# Altium project GPS Tracking Device.PrjPcb
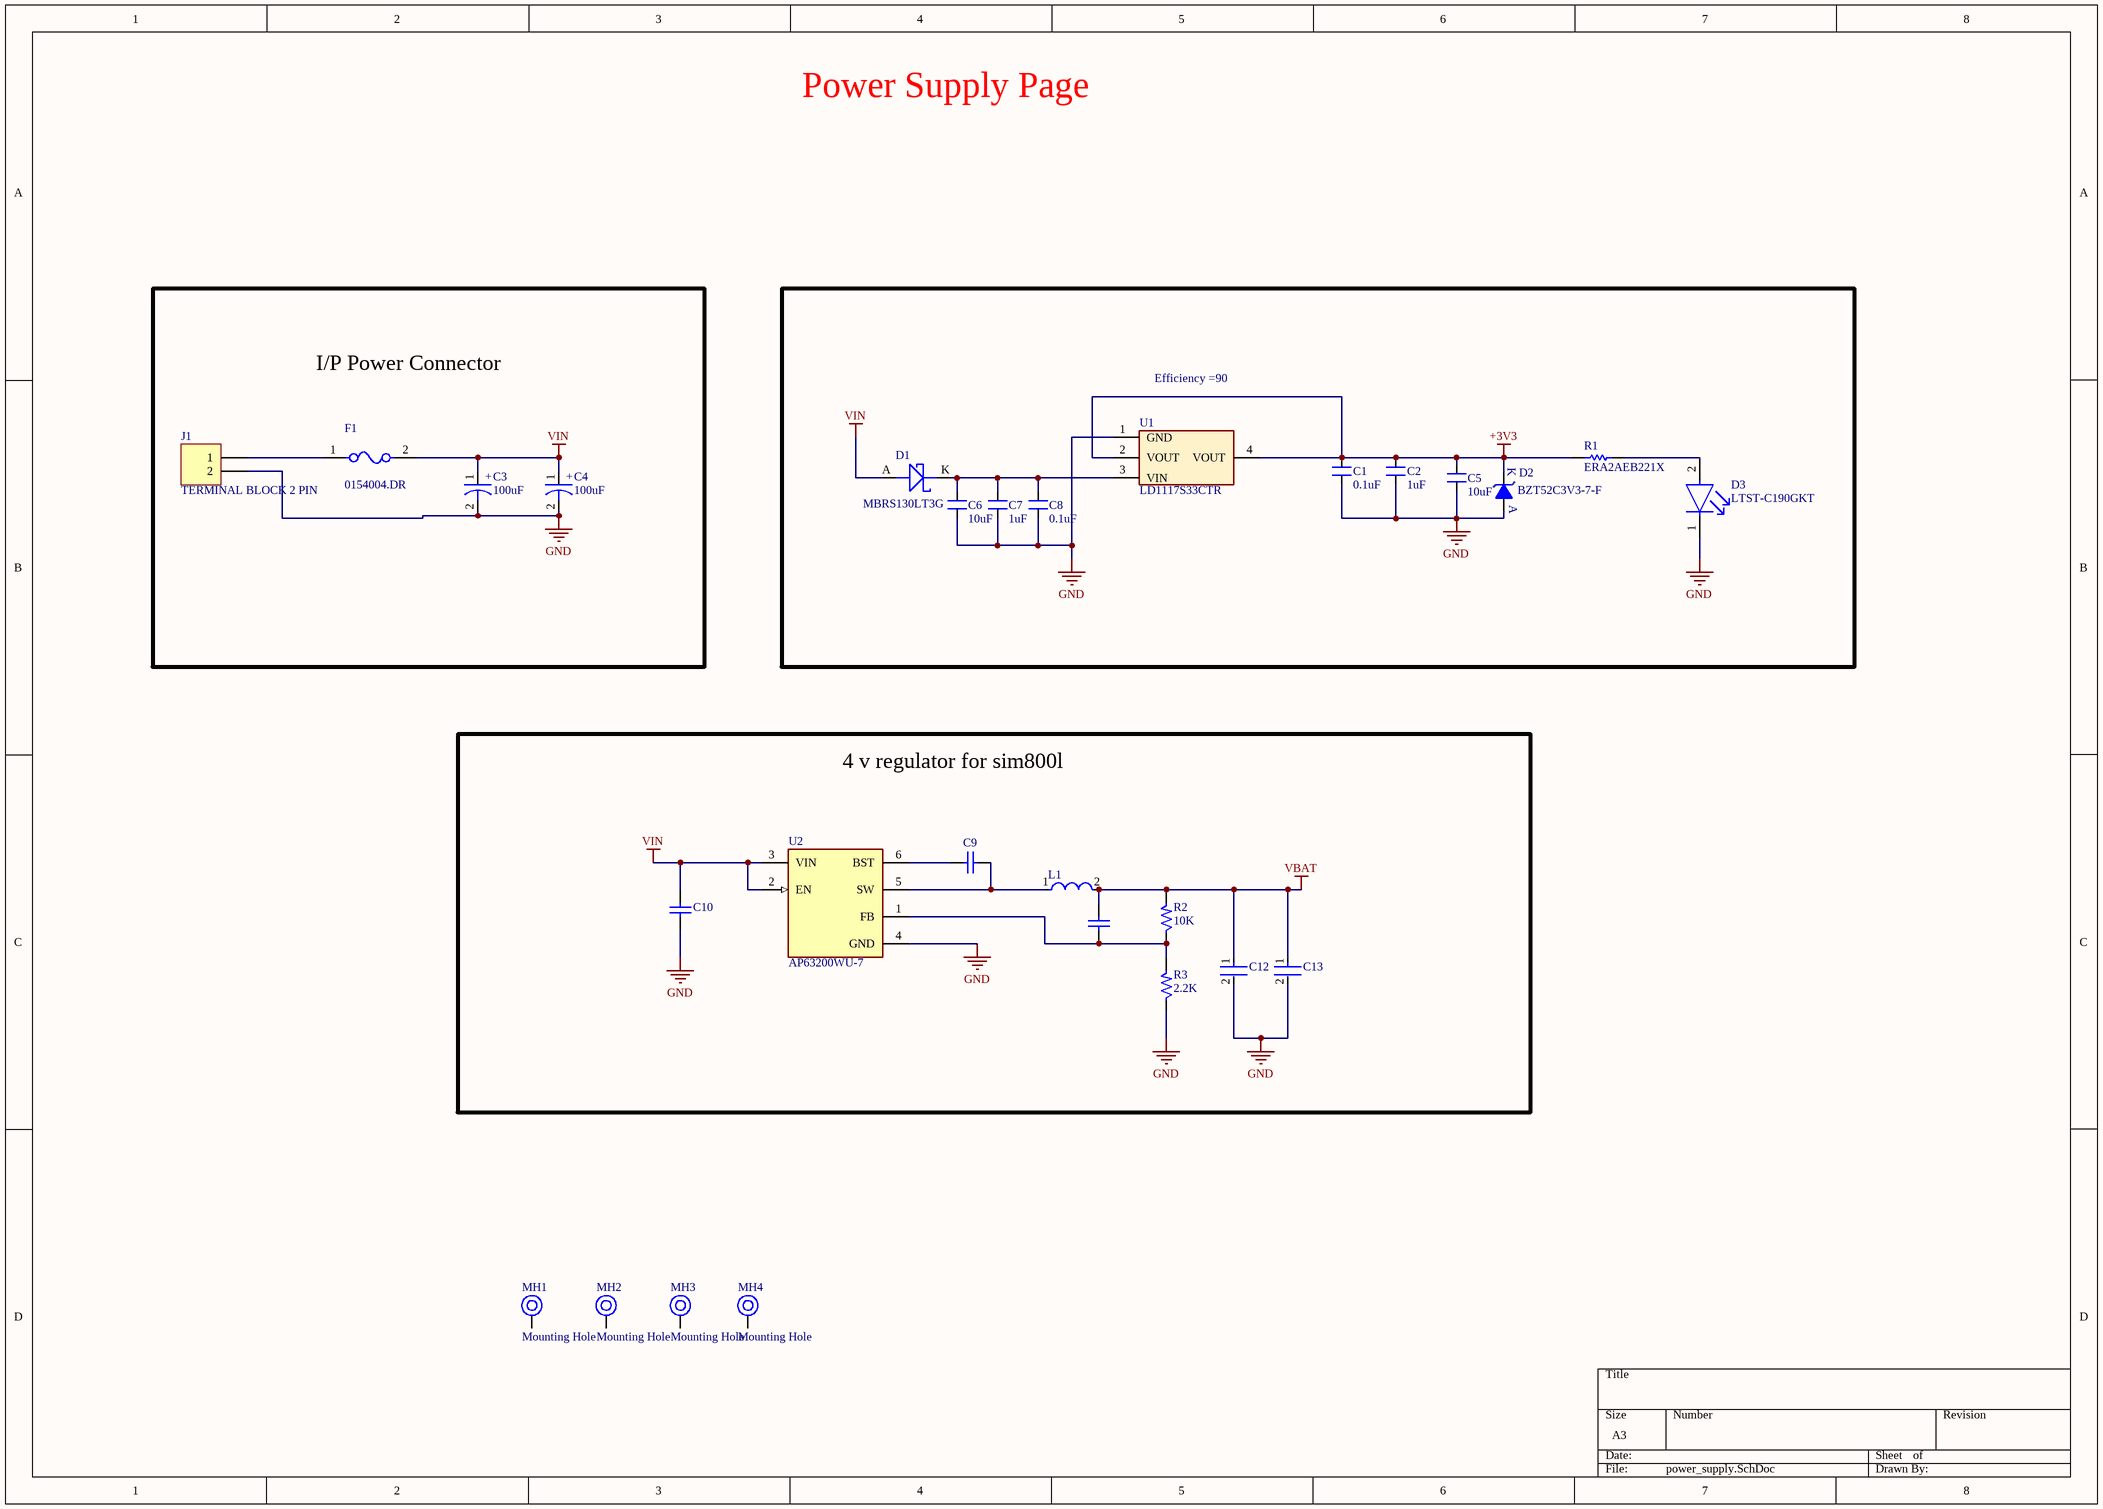
[diagram p0: power_supply.SchDoc]
3 sheets, 68 parts. Net scope: global (net labels, ports and power ports of the same name join across sheets).
Board file: GPS Tracking Device.PcbDoc
Sheets:
  power_supply.SchDoc
  ESP32_MCU.SchDoc
  GSM & SIM.SchDoc

## Sheet power_supply.SchDoc
size A3; SheetNumber: 1; SheetTotal: 3; SPICEModelCacheKXPDIREM: <root> / <DocumentId>KXPDIREM</DocumentId> / <CacheFrame Number="0"> / <Model Name="amk105cbj106_v-f" Kind="CKT"> / <Text>* AMK105CBJ106_V-F     SPICE MODEL  ( General Type ) / *-------------------------------------------------------------------------------------------------------- / * Model Generated by TAIYO YUDEN Corporation (http://www.ty-top.com) / * Version 1.0 / * TAIYO YUDEN Control No. 170508_140220 / *-------------------------------------------------------------------------------------------------------- / * / * Products Name : Multilayer Ceramic Capacitors / * / * Characteristics : / *     Capacitance : 10 uF , Rated Voltage : 4.0V , TCC : X5R / *     Case Size : 1.0 x 0.5 / 0.039 x 0.02 [mm/inch] , Thickness : 0.5 / 0.02 [mm/inch] / *     (Conditions: Temperature = 25 degC , DC Bias Current/Voltage = 0A / 0V) / * / * Frequency Range : 40Hz - 3GHz / * / * External Node Assignments : / * / *  1  o---| |---o  2 / * / *-------------------------------------------------------------------------------------------------------- / .SubCkt AMK105CBJ106_V-F 1 2 / **************************** / C0 1 110 7.4107u / Cm 1 101 0.96702u / C1 101 102 0.739u / Rc1 101 102 366.75 / C2 102 103 0.24354u / Rc2 102 103 47.641 / C3 103 110 0.14706u / Rc3 103 110 4.2209 / C2m 1 301 1.7678u / C21 301 302 4.7117u / Rc21 301 302 845.67 / C22 302 303 4.121u / Rc22 302 303 734.55 / C23 303 304 4.3096u / Rc23 303 304 562.67 / C24 304 305 2.6992u / Rc24 304 305 26.221 / C25 305 306 1.2642u / Rc25 305 306 46.471 / C26 306 307 2.5266u / Rc26 306 307 22.579 / C27 307 308 0.76655u / Rc27 307 308 4.4337 / C28 308 309 0.64691u / Rc28 308 309 2.6063 / C29 309 110 4901.4p / Rc29 309 110 1.4662 / Rp0 1 110 10Meg / L0 110 120 0.1817n / Lm 120 130 0.19649n / L1 120 121 0.098105n / RL1 121 130 0.12128 / L2 120 122 0.12674n / RL2 122 130 0.26881 / L3 120 123 0.76569n / RL3 123 130 0.47843m / CR 120 124 1.5221u / LR 124 125 0.35836n / RR 125 130 25.315m / CL 130 140 2.9027p / LL 130 140 0.10763n / RL 130 140 26.768 / Rs 140 2 2.766m / **************************** / .ends</Text> / </Model> / </CacheFrame> / </root>

### Parts
C1  0.1uF  [CAP_0805]
C2  1uF  [CAP_0805]
C3  100uF  [ACAP_P305_D393_H393_RAD]
C4  100uF  [ACAP_P305_D393_H393_RAD]
C5  10uF  [CAP_1206]
C6  10uF  [CAP_1206]
C7  1uF  [CAP_0805]
C8  0.1uF  [CAP_0805]
C9  04026D104KAT2A  [CAPC1005X56X25LL10T15]  (value not drawn)
C10  AMK105CBJ106MV-F  [CAPC0402(1005)60_N]  (value not drawn)
C11  GRM1555C1H101JA01D  [CAPC1005X55X25ML05T10]  (value not drawn)
C12  GRM21BR60J226ME39L  [FP-GRM21B-0_15-IPC_B]  (value not drawn)
C13  GRM21BR60J226ME39L  [FP-GRM21B-0_15-IPC_B]  (value not drawn)
D1  MBRS130LT3G  [DIO_SMB_DO-214AA]
D2  BZT52C3V3-7-F  [DIO_SOD-123]
D3  LTST-C190GKT  [FP-LTST-C190GKT-MFG]
F1  0154004.DR  [FP-0154-MFG]
J1  TERMINAL BLOCK 2 PIN  [CON2_P196_1729128_TH_ST]
L1  MLZ1005M2R2WT000  [FP-MLZ1005-IPC_B]  (value not drawn)
MH1  Mounting Hole  [MOUNTING]
MH2  Mounting Hole  [MOUNTING]
MH3  Mounting Hole  [MOUNTING]
MH4  Mounting Hole  [MOUNTING]
R1  ERA2AEB221X  [RESC1005X40X25LL10T10]
R2  10K  [RES_0603]
R3  2.2K  [RES_0805]
U1  LD1117S33CTR  [SOT223_3]
U2  AP63200WU-7  [FP-TSOT26-MFG]

### Blocks framed on the sheet
I/P Power Connector: C3 C4 F1 J1
Efficiency =90: C1 C2 C5-C8 D1-D3 R1 U1
4 v regulator for sim800l: C9-C13 L1 R2 R3 U2

### Nets
+3V3: C1.2 C2.2 C5.2 D2.K R1.1 U1.2(VOUT) U1.4(VOUT)
GND: C1.1 C2.1 C3.2 C4.2 C5.1 C6.1 C7.1 C8.1 C10.1 C12.2 C13.2 D2.A D3.1(C) J1.2 R3.1 U1.1(GND) U2.4(GND)
VBAT: C11.2 C12.1 C13.1 L1.2 R2.2
VIN: C3.1 C4.1 C10.2 D1.A F1.2 U2.2(EN) U2.3(VIN)
NetC6_2: C6.2 C7.2 C8.2 D1.K U1.3(VIN)
NetC9_1: C9.1 U2.6(BST)
NetC9_2: C9.2 L1.1 U2.5(SW)
NetC11_1: C11.1 R2.1 R3.2 U2.1(FB)
NetD3_2: D3.2(A) R1.2
NetF1_1: F1.1 J1.1

Not connected (* = marked no-connect by the designer): MH1 1; MH2 1; MH3 1; MH4 1

### Notes on the sheet
- Power Supply Page
- (in symbol CAP-P_100uF-50V-20%-RAD) +

### Library data of the parts
C1 C8 = CAP_0.1uF-50V-10%-0805: 0.1µF ±10% 50V Ceramic Capacitor X7R 0805 (2012 Metric); Manufacturer: Samsung; Manufacturer Part Number: CL21B104KBCNNNC; Alternate Part Number-1: NA; Case/Package: 0805; Supplier-1: SIRICOM; Supplier Part Number-1: 0805B104K500CT
C2 C7 = CAP_1uF-50V-5%-0805: 1µF ±5% 50V Ceramic Capacitor X7R 0805 (2012 Metric); Manufacturer: Samsung; Manufacturer Part Number: CC0805JKX7R9BB105; Alternate Part Number-1: 0805F105M500NT; Case/Package: 0805; Supplier-1: SIRICOM; Supplier Part Number-1: CL21B105KBFNNNE
C3 C4 = CAP-P_100uF-50V-20%-RAD: 100µF 50V Aluminum Polymer Capacitor Radial, Can - SMD 28mOhm 4000 Hrs @ 125°C; Manufacturer: Nichicon; Manufacturer Part Number: GYA1H101MCQ1GS; Alternate Part Number-1: VEU101M1HTR-1010; Case/Package: Radial-SMD; Supplier-1: SP ROAD; Supplier Part Number-1: GYA1H101MCQ1GS
C5 C6 = CAP_10uF-50V-10%-1206: 10µF ±10% 50V Ceramic Capacitor X7R 1206 (3216 Metric); Manufacturer: KEMET; Manufacturer Part Number: CL31B106KBHNNNE; Alternate Part Number-1: GRT31CR61H106ME01L; Case/Package: 1206; Supplier-1: SIRICOM; Supplier Part Number-1: CC1206KKX5R9BB106
C9 = CMP-2008-02743-1: Manufacturer: AVX Interconnect / Elco; Part Number: 04026D104KAT2A
C10 = CMP-1034-02139-2: None; Voltage Rating: 4V; Capacitance: 10uF; Dielectric: X5R; Tolerance: 20%; Width: 0.02inch; Halogen Free: Halogen Free; Termination: SMD/SMT; Voltage Rating (DC): 4V; Length: 0.039inch; RoHS Compliant: Yes; Case/Package: 0402; Mount: Surface Mount; Case Code (Imperial): 0402; Min Operating Temperature: -55°C; Packaging: Tape and Reel; Height: 0.5mm; Case Code (Metric): 1005; Max Operating Temperature: 85°C; Series: M; Package Quantity: 1; Thickness: 0.028inch; Construction: Flat
C11 = CMP-2008-03915-1: Manufacturer: Murata; Part Number: GRM1555C1H101JA01D
C12 C13 = CMP-2007-03385-2: Chip Multilayer Ceramic Capacitors for General Purpose, 0805, 22uF, X5R, 15%, 20%, 6.3V; Material: Ceramic; Max Operating Temperature: 85°C; Voltage: 6.3V; Min Operating Temperature: -55°C; Case/Package: 0805; Thickness: 0.053inch; Dielectric: X5R; Packaging: Tape and Reel; Depth: 1.25mm; Termination: SMD/SMT; Voltage Rating (DC): 6.3V; Radiation Hardening: No; Tolerance: 20%; Mount: Surface Mount; Lead Free: Lead Free; Package Quantity: 1; REACH SVHC: No SVHC; Voltage Rating: 6.3V; Capacitance: 22uF; Length: 2mm; Case Code (Imperial): 0805; Case Code (Metric): 2012; Width: 0.049inch; Height: 1.25mm
D1 = DIO-S_445mV-30V-2A-SMB: Diode Schottky 30V 2A Surface Mount SMB; Manufacturer: ON Semiconductor; Alternate Part Number-1: NA; Manufacturer Part Number: MBRS130LT3G; Case/Package: SMB; Supplier-1: ARROW; Supplier Part Number-1: MBRS130LT3G
D2 = DIO-Z_3.3V-500mW-SOD123: Zener Diode 3.3V 500mW ±6% Surface Mount SOD-123; Manufacturer: Diodes Incorporated; Alternate Part Number-1: NA; Manufacturer Part Number: BZT52C3V3-7-F; Case/Package: SOD-123; Supplier-1: Digikey; Supplier Part Number-1: BZT52C3V3-FDICT-ND
D3 = CMP-22017-000005-2: LED GREEN CLEAR CHIP SMD; Dominant Wavelength: 569nm; Reverse Voltage: 5V; Lens Color: Colorless; Viewing Angle: 130°; Voltage: 2V; Forward Current: 30mA; Power Dissipation: 100mW; Luminous Intensity: 6mcd; Number of LEDs: 1; Forward Voltage: 2.1V; Wavelength: 565nm; Test Current: 10mA; Min Operating Temperature: -55°C; Lens Style: Clear; Mount: Surface Mount; Width: 0.8mm; Packaging: Tape and Reel; Lens Transparency: Clear; Case Code (Metric): 1608; Depth: 0.8mm; Case Code (Imperial): 0603; Case/Package: 0603; Number of Pins: 2; Max Operating Temperature: 85°C; Lead Free: Lead Free; Number of Elements: 1; Length: 1.6mm; Height: 0.8mm; Package Quantity: 1; Power Rating: 100mW; Radiation Hardening: No; Illumination Color: Green; Color: Green
F1 = CMP-08605-000003-1: FUSE BRD MNT 4A 125VAC/VDC 2SMD; Manufacturer: Littelfuse; Fuse Blow Speed: Fast; Max Fuse Ac Voltage: 125V; Lead Free: Yes; Device Class L3: unset; Manufacturer Part Number: 0154004.DR; Device Class L2: Fuses; Package: 0154; ComponentLink2Description: Datasheet; Temperature Range Low: -55°C; Temperature Range High: +125°C; Device Class L1: Circuit Protection; Height: 3.81mm; Temperature: -55°C to +125°C; Mouser Description: Surface Mount Fuses Fuseblock w/ fuse 4A OMNI BLOK 154; Automotive: No; Digikey Description: FUSE BRD MNT 4A 125VAC/VDC 2SMD; RoHS: TRUE; Category: Fuse; Fuse Current: 4A; Max Fuse Dc Voltage: 125V; ComponentLink2URL: https://www.littelfuse.com/~/media/electronics/datasheets/fuses/littelfuse_fuse_154_154t_154l_154tl_datasheet.pdf.pdf; Octopart: https://octopart.com/0154004.dr-littelfuse-565861
J1 = CON-TB_2X1-196-ST-TH: 2 Pins, 1 Row 5mm Pitch, straight Connector, male; Manufacturer: Phoenix Contact; Manufacturer Part Number: MKDSN1,5/2; Alternate Part Number-1: NA; Case/Package: TH-CON; Supplier-1: SP ROAD; Supplier Part Number-1: MKDSN1,5/2
L1 = CMP-08253-000201-1: Shielded Multilayer Inductor 2.2uH ±20% 350mA 715mΩ SMD 0402; Core Material: Ferrite; Saturation Current: 60mA; DC Resistance (DCR): 715mR; Self Resonant Frequency: 120MHz; Test Frequency: 2MHz; RoHS Compliant: Yes; Tolerance: 20%; Current Rating: 350mA; Min Operating Temperature: -55°C; Case Code (Imperial): 0402; Length: 0.039inch; Case/Package: 0402; Inductance: 2.2uH; Mount: Surface Mount; Package Quantity: 10000; Shielding: Shielded; Width: 0.02inch; Case Code (Metric): 1005; Height - Seated (Max): 0.022inch; Max Operating Temperature: 125°C; Packaging: Tape and Reel
MH1-MH4 = MH_3.5H_6D: Manufacturer Part Number: NA; Case/Package: TH; Manufacturer: NA; Supplier-1: NA; Supplier Part Number-1: NA; Alternate Part Number-1: NA
R1 = CMP-2002-05880-1: Manufacturer: Panasonic; Part Number: ERA2AEB221X
R2 = RES_10K-0.1W-1%-0603: 10 kOhms ±1% 0.1W, 1/10W Chip Resistor 0603 (1608 Metric) Automotive AEC-Q200 Thick Film; Manufacturer: Walsin; Manufacturer Part Number: WR06X1002FTL; Alternate Part Number-1: 0603WAJ0103T5E; Case/Package: 0603; Supplier-1: SIRICOM; Supplier Part Number-1: WR06X1002FTL
R3 = RES_2.2K-0.125W-1%-0805: 2.2 kOhms ±1% 0.125W, 1/8W Chip Resistor 0805 (2012 Metric) Thick Film; Manufacturer: Stackpole Electronics; Manufacturer Part Number: CRG0805F2K2; Alternate Part Number-1: CR0805F82201G; Case/Package: 0805; Supplier-1: SIRICOM; Supplier Part Number-1: WR08X2201FTL
U1 = REG_15V-3.3V-0.9A-12W-SOT223: Linear Voltage Regulator IC 1 Output 800mA SOT-223; Manufacturer: STMicroelectronics; Alternate Part Number-1: NA; Manufacturer Part Number: LD1117S33CTR; Case/Package: SOT223; Supplier-1: SP ROAD; Supplier Part Number-1: LD1117S33CTR
U2 = CMP-12757-000010-1: IC REG BUCK ADJUSTABLE 2A TSOT26; Manufacturer: Diodes Inc.; Switching Frequency: 500kHz; Max Supply Voltage: 32V; Number Of Outputs: 1; Nominal Supply Current: 22uA; Min Supply Voltage: 3.8V; Output Type: AdjustableProgrammable; Max Junction Temp: +160°C; Standoff Height: 0.01mm; Octopart: https://octopart.com/ap63200wu-7-diodes+inc.-98099548; Height: 1mm; Temperature Range Low: -40°C; Output Current: 2A; ComponentLink2URL: https://www.diodes.com/assets/Datasheets/AP63200-AP63201-AP63203-AP63205.pdf; Switching Topology: Buck; Automotive: No; Device Class L1: Integrated Circuits (ICs); Ipc Land Pattern Name: SOT95P280X100-6; Package: TSOT26; Temperature Range High: +85°C; RoHS: TRUE; Ambient Temperature Range High: +85°C; Device Class L3: Voltage Regulators - Switching; Temperature: -40°C to +85°C; Device Class L2: Power Management ICs; Footprint Url: https://www.diodes.com/assets/Package-Files/TSOT26.pdf; Mouser Description: AP63200 Series 1.2 V 2 A Adjustable Synchronous Buck Converter - TSOT-26; Category: IC; ComponentLink2Description: Datasheet; Digikey Description: IC REG BUCK ADJUSTABLE 2A TSOT26; Lead Free: Yes; Ambient Temperature Range Low: -40°C; Manufacturer Part Number: AP63200WU-7

## Sheet ESP32_MCU.SchDoc
size A3; SheetNumber: 2; SheetTotal: 3
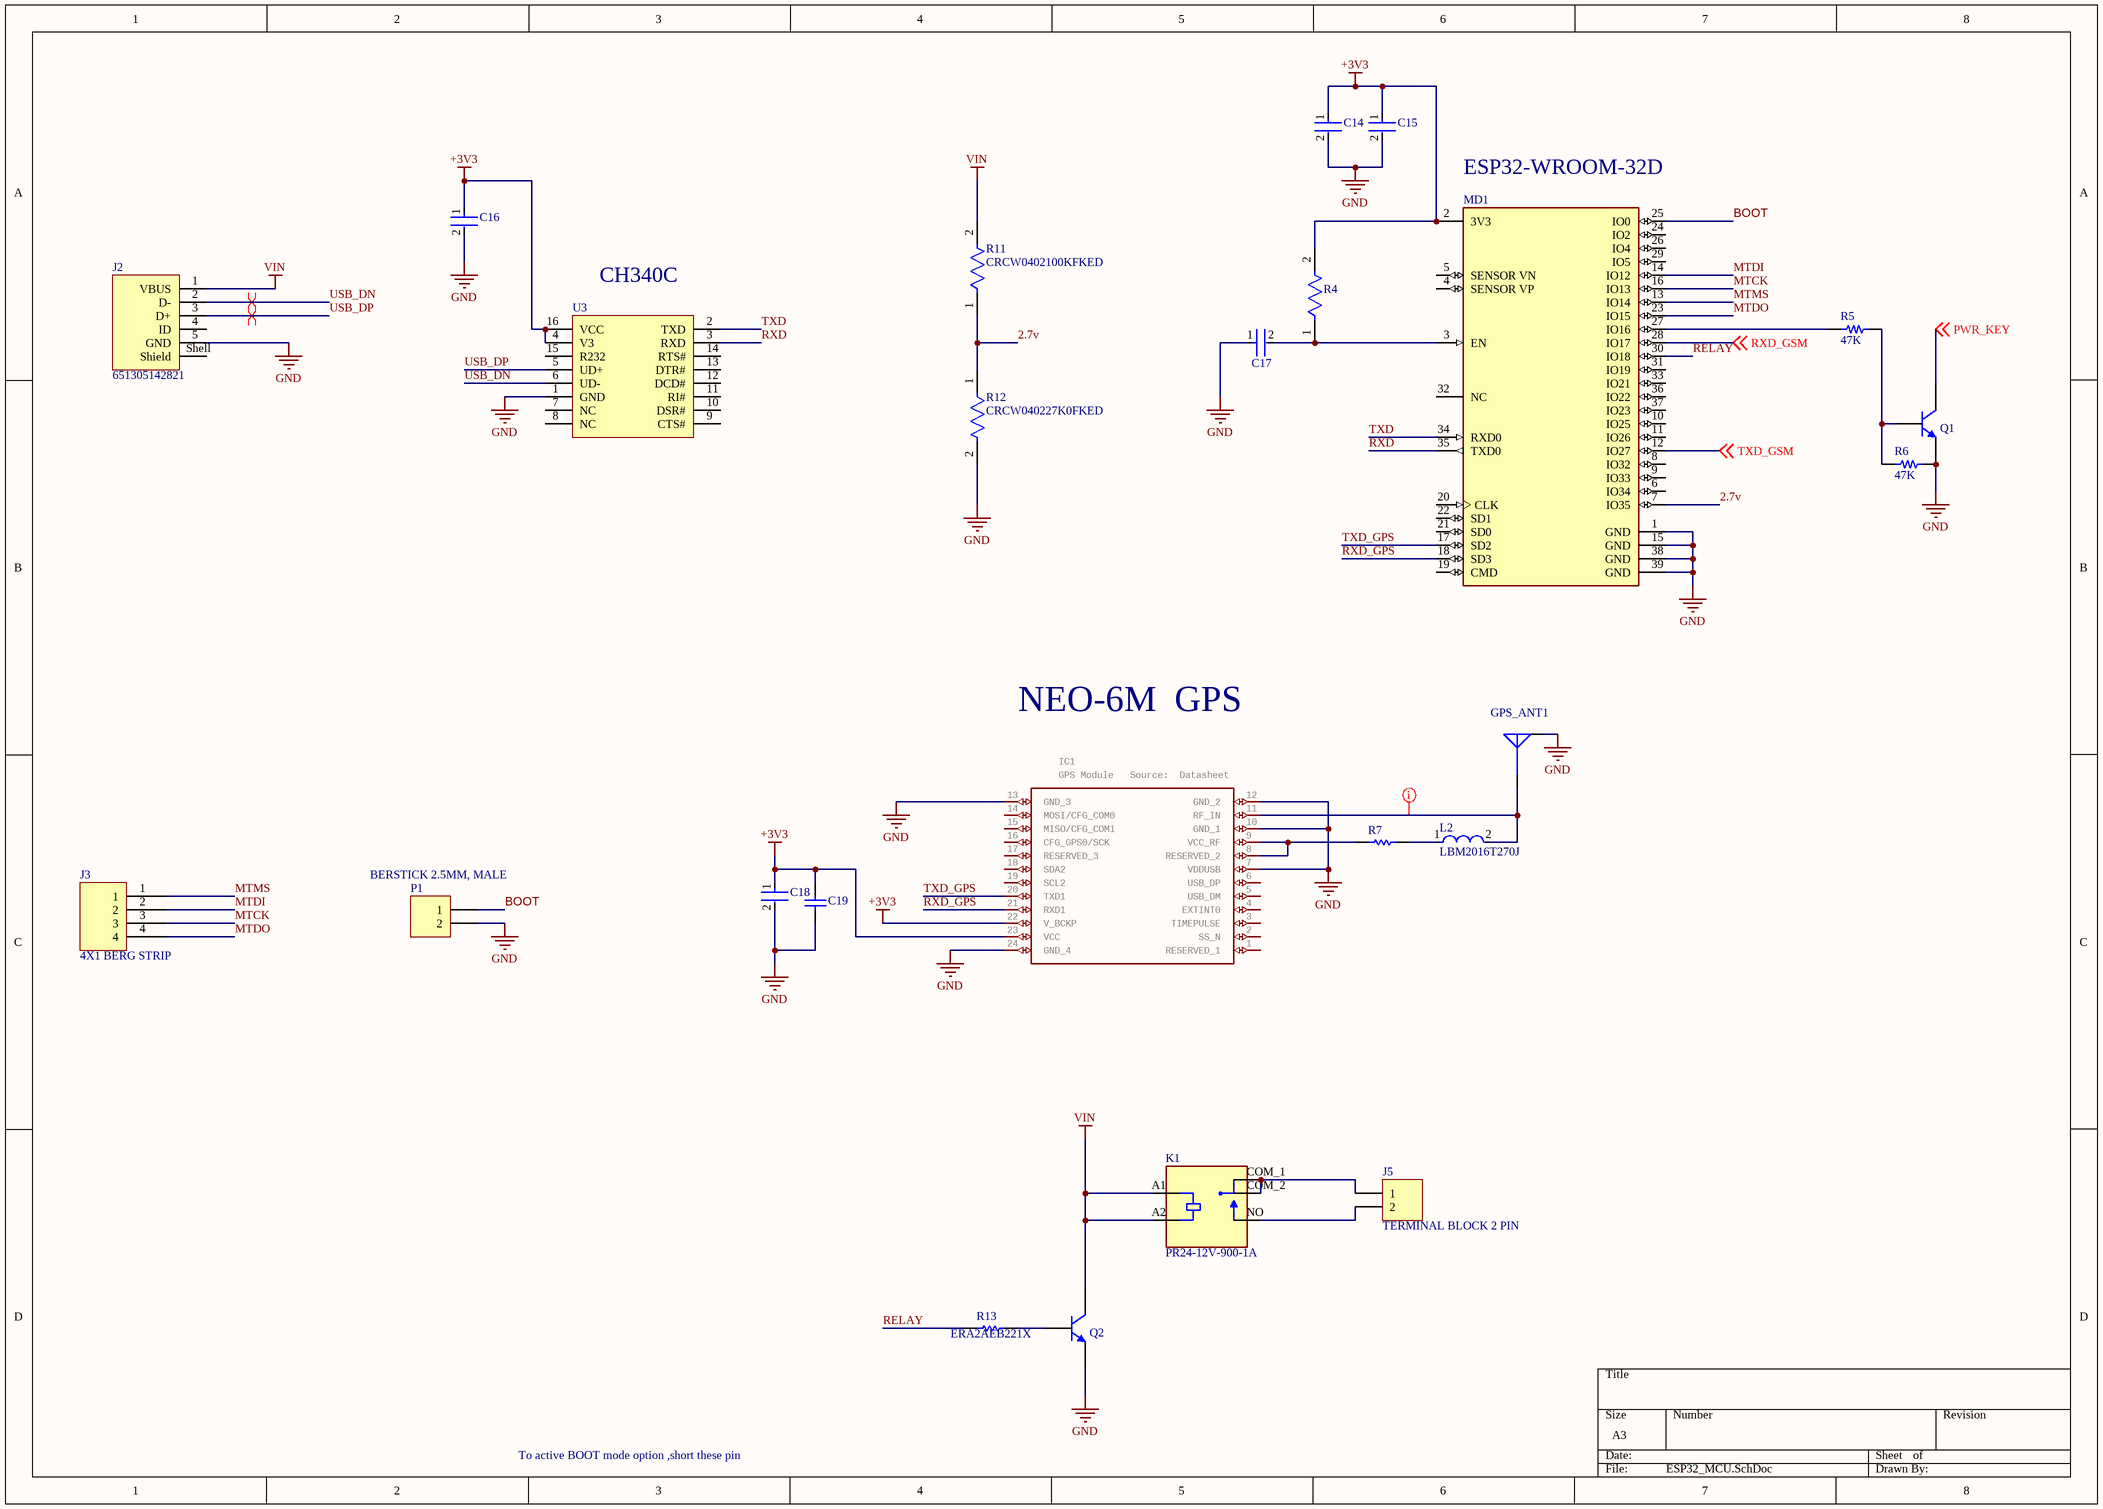
[diagram p1: ESP32_MCU.SchDoc]

### Parts
C14  C0402C104K8RACTU  [FP-C0402-BB-MFG]  (value not drawn)
C15  C0402C106M9PACTU  [FP-C0402C106M9PACTU-MFG]  (value not drawn)
C16  C0402C104K8RACTU  [FP-C0402-BB-MFG]  (value not drawn)
C17  CC0402KRX5R5BB105  [FP-CC0402-MFG]  (value not drawn)
C18  C0402C104K8RACTU  [FP-C0402-BB-MFG]  (value not drawn)
C19  C0402C475M7PACTU  [CAPC1005X60X30ML05T10]  (value not drawn)
GPS_ANT1  UFL  [MOLEX SD-734120110]  (value not drawn)
IC1  GPS Module   Source:  Datasheet  [NEO6M0001]
J2  651305142821  [651305142821]
J3  4X1 BERG STRIP  [CON4_100_40D72_TH_ST_MALE]
J5  TERMINAL BLOCK 2 PIN  [CON2_P196_1729128_TH_ST]
K1  PR24-12V-900-1A  [RELAY_PR24-12V-900-1A]
L2  LBM2016T270J  [FP-LBM2016-1_6-0_2-IPC_C]
MD1  ESP32-WROOM-32D  [FP-ESP32-WROOM-32D-MFG]
P1  BERSTICK 2.5MM, MALE  [CON2_100_43D62_TH_ST]
Q1  8050  [SOT-23-3 2.9X2.4MM P0.95MM]  (value not drawn)
Q2  8050  [SOT-23-3 2.9X2.4MM P0.95MM]  (value not drawn)
R4  CRCW040210K0JNED  [FP-CRCW0402-e3-IPC_B]  (value not drawn)
R5  47K  [RES 0603_1608]
R6  47K  [RES 0603_1608]
R7  CRCW040222R0FKED  [RESC1005X40X25LL05T05]  (value not drawn)
R11  CRCW0402100KFKED  [FP-CRCW0402-e3-IPC_C]
R12  CRCW040227K0FKED  [FP-CRCW0402-e3-IPC_A]
R13  ERA2AEB221X  [RESC1005X40X25LL10T10]
U3  CH340C  [SOIC16_50_284_25X90_SMT]

### Nets
+3V3: C14.1 C15.1 C16.1 C18.1 C19.2 IC1.22(V_BCKP) IC1.23(VCC) MD1.2(3V3) R4.2 U3.4(V3) U3.16(VCC)
GND: C14.2 C15.2 C16.2 C17.1 C18.2 C19.1 GPS_ANT1.G IC1.7(VDDUSB) IC1.10(GND_1) IC1.12(GND_2) IC1.13(GND_3) IC1.24(GND_4) J2.5(GND) MD1.1(GND) MD1.15(GND) MD1.38(GND) MD1.39(GND) P1.2 Q1.2(E) Q2.2(E) R6.1 R12.2 U3.1(GND)
VIN: J2.1(VBUS) K1.A1(COIL1) K1.A2(COIL2) Q2.3(C) R11.2
2.7v: MD1.7(IO35) R11.1 R12.1
BOOT: MD1.25(IO0) P1.1
MTCK: J3.3 MD1.16(IO13)
MTDI: J3.2 MD1.14(IO12)
MTDO: J3.4 MD1.23(IO15)
MTMS: J3.1 MD1.13(IO14)
PWR_KEY: Q1.3(C) ; off-sheet PWR_KEY
RELAY: MD1.30(IO18) R13.1
RXD: MD1.35(TXD0) U3.3(RXD)
RXD_GPS: IC1.21(RXD1) MD1.18(SD3)
RXD_GSM: MD1.28(IO17) ; off-sheet RXD_GSM
TXD: MD1.34(RXD0) U3.2(TXD)
TXD_GPS: IC1.20(TXD1) MD1.17(SD2)
TXD_GSM: MD1.12(IO27) ; off-sheet TXD_GSM
USB_DN: J2.2(D-) U3.6(UD-)
USB_DP: J2.3(D+) U3.5(UD+)
NetC17_2: C17.2 MD1.3(EN) R4.1
NetGPS_ANT1_S: GPS_ANT1.S IC1.11(RF_IN) L2.2
NetIC1_8: IC1.8(RESERVED_2) IC1.9(VCC_RF) R7.1
NetJ5_1: J5.1 K1.COM_1(COM1) K1.COM_2(COM2)
NetJ5_2: J5.2 K1.NO
NetL2_1: L2.1 R7.2
NetMD1_27: MD1.27(IO16) R5.2
NetQ1_1: Q1.1(B) R5.1 R6.2
NetQ2_1: Q2.1(B) R13.2

Not connected (* = marked no-connect by the designer): IC1 1(RESERVED_1) 2(SS_N) 3(TIMEPULSE) 4(EXTINT0) 5(USB_DM) 6(USB_DP) 14(MOSI/CFG_COM0) 15(MISO/CFG_COM1) 16(CFG_GPS0/SCK) 17(RESERVED_3) 18(SDA2) 19(SCL2); J2 4(ID) Shell(Shield); MD1 4(SENSOR_VP) 5(SENSOR_VN) 6(IO34) 8(IO32) 9(IO33) 10(IO25) 11(IO26) 19(CMD) 20(CLK) 21(SD0) 22(SD1) 24(IO2) 26(IO4) 29(IO5) 31(IO19) 32(NC) 33(IO21) 36(IO22) 37(IO23); U3 7(NC) 8(NC) 9(CTS#) 10(DSR#) 11(RI#) 12(DCD#) 13(DTR#) 14(RTS#) 15(R232)

### Layout directives
differential pair; differential pair class diff_90: USB_DN, USB_DP
net class GPS_ANT: NetGPS_ANT1_S

### Notes on the sheet
- NEO-6M  GPS
- To active BOOT mode option ,short these pin

### Library data of the parts
C14 C16 C18 = CMP-2008-03086-2: CAP CER 0.1UF 10V X7R 0402; Manufacturer: Kemet; Capacitance: 0.10 μF; Tolerance: 0.1; Temperature Coefficient: 15%; Value: 0.10 μF; Material: Ceramic; Automotive: No; Temperature Range High: +125°C; Octopart: https://octopart.com/c0402c104k8ractu-kemet-106349; ComponentLink2Description: Datasheet; ComponentLink2URL: https://content.kemet.com/datasheets/KEM_C1002_X7R_SMD.pdf; Temperature: -55°C to +125°C; RoHS: TRUE; Temperature Range Low: -55°C; Temperature Characteristic: X7R; Lead Free: Yes; Height: 0.55mm; Manufacturer Part Number: C0402C104K8RACTU; Voltage Rating: 10 V; Category: Cap; Device Class L3: Ceramic Capacitors; Digikey Description: CAP CER 0.1UF 10V X7R 0402; Package: C0402-BB; Device Class L1: Passive Components; Ipc Land Pattern Name: CAPC10050X50; Mouser Description: Multilayer Ceramic Capacitors MLCC - SMD/SMT 10volts 0.1uF X7R 10%; Device Class L2: Capacitors
C15 = CMP-03020-034678-1: CAP CER 10UF 6.3V X5R 0402; Tolerance: 20%; Dielectric Material: Ceramic; Voltage Rating: 6.3V; Thickness: 0.028inch; REACH SVHC: No SVHC; RoHS Compliant: Yes; Case Code (Metric): 1005; Lead Free: Lead Free; Length: 0.039inch; Max Operating Temperature: 85°C; Capacitance: 10uF; Voltage Rating (DC): 6.3V; Min Operating Temperature: -55°C; Case/Package: 0402; Mount: Surface Mount; Case Code (Imperial): 0402; Dielectric: X5R; Packaging: Cut Tape; Width: 0.02inch
C17 = CMP-2100-03591-2: CAP CER 1UF 6.3V X5R 0402; Manufacturer: YAGEO; Automotive Grade: NA; Material: Ceramic; Tolerance: 0.1; Temperature Coefficient: 30ppm/°C; Voltage Rating: 6.3 V; Temperature Range Low: -55°C; Digikey Description: CAP CER 1UF 6.3V X5R 0402; Capacitance: 1 uF; Height: 0.55mm; Automotive: No; ComponentLink2URL: http://www.yageo.com/documents/recent/UPY-GP_NP0_16V-to-50V_16.pdf; Device Class L2: Capacitors; RoHS: TRUE; Temperature Range High: +125°C; Device Class L3: Ceramic Capacitors; Device Class L1: Passive Components; Temperature Characteristic: X5R; Package: CC0402; Octopart: https://octopart.com/cc0402krx5r5bb105-yageo-42244618; ComponentLink2Description: Datasheet; Temperature: -55°C to +125°C; Manufacturer Part Number: CC0402KRX5R5BB105; Mouser Description: Multilayer Ceramic Capacitors MLCC - SMD/SMT 1uF 6.3V X5R 10%; Category: Cap; Footprint Url: http://www.yageo.com/exep/pages/download/literatures/UPY-C_GEN_24.pdf; Lead Free: Yes; Ipc Land Pattern Name: CAPC10050X50; Value: 1 uF
C19 = CMP-2008-02047-1: Manufacturer: Kemet; Part Number: C0402C475M7PACTU
GPS_ANT1 = UFL MOLEX SD-734120110: PartNumber: MOLEX SD-734120110
IC1 = NEO-6M-0-001: Manufacturer_Name: U-Blox; GateName_1: G$1; SymbolName_1: NEO-6M-0-001; LibraryName: NEO-6M-0-001; DeviceSetName: NEO-6M-0-001; Package: NEO6M0001; Manufacturer_Part_Number: NEO-6M-0-001; Height: 2.6mm
J2 = CMP-1502-03247-2: NexarPartId: 19991175; Operating Supply Voltage: 30V; Current Rating: 1A; Contact Resistance: 20mΩ; Connector Type: USB; Number of Contacts: 5; USB Standard: USB 2.0; Gender: Receptacle; Insulation Resistance: 1GΩ; REACH SVHC: Unknown; Contact Plating: Gold; Min Operating Temperature: -40°C; Features: Shielded; RoHS: Compliant; Contact Material: Copper; Packaging: Tape and Reel; Termination: SMD/SMT; Max Operating Temperature: 105°C; Orientation: Horizontal; Number of Pins: 5; Mount: Horizontal, Surface Mount; Lead Free: Lead Free
J3 = CON-BS-PLG_4X1-100-ST-TH: 4 Pins, 1 Row 2.54mm Pitch, Straight bergstrip, Male; Manufacturer: NA; Manufacturer Part Number: NA; Case/Package: TH-CON; Supplier-1: SP ROAD; Supplier Part Number-1: NA; Alternate Part Number-1: NA
J5 = CON-TB_2X1-196-ST-TH: as J1 on sheet power_supply; Case/Package: TH-CON; Supplier-1: SP ROAD; Supplier Part Number-1: MKDSN1,5/2
K1 = PR24-12V-900-1A: 27.4 x 31.8 x 20 mm, 12 V, 40 A, SPST (1 Form A), Power Relay; MF: CUI Devices; SnapEDA_Link: https://www.snapeda.com/parts/PR24-12V-900-1A/CUI+Devices/view-part/?ref=snap; Package: None; Value: *; CUI_purchase_URL: https://www.cuidevices.com/product/relays/power-relays/pr24-12v-900-1a?utm_source=snapeda.com&utm_medium=referral&utm_campaign=snapedaBOM; MP: PR24-12V-900-1A; Check_prices: https://www.snapeda.com/parts/PR24-12V-900-1A/CUI+Devices/view-part/?ref=eda
L2 = CMP-14484-001072-1: SMD Inductors 27uH ±5% 0.13A 4.16Ω 0806; Shielding: Unshielded; DC Current: 130mA; DC Resistance (DCR): 3.2R; Q Factor: 25; Self Resonant Frequency: 16MHz; Test Frequency: 2.52MHz; Core Material: Ferrite; Height: 1.6mm; Package Quantity: 2000; RoHS Compliant: Yes; Height - Seated (Max): 0.071inch; Tolerance: 5%; Max Operating Temperature: 105°C; Inductance Tolerance: 5%; Depth: 1.8mm; Length: 2mm; Mount: Surface Mount; Radiation Hardening: No; Width: 0.063inch; Packaging: Tape and Reel; Inductance: 27uH; Termination: SMD/SMT; Lead Free: Lead Free; Case Code (Imperial): 0806; Max DC Current: 130mA; Military Standard: Not; Series: LB; Current Rating: 130mA; Case Code (Metric): 2016; Resistor Type: Wirewound; Halogen Free: Halogen Free; Case/Package: 0806; Min Operating Temperature: -40°C
MD1 = CMP-194065-000003-1: WIFI MODULE 32MBITS SPI FLASH; Manufacturer: Espressif Systems; Max Supply Voltage: 3.6V; Nominal Supply Current: 500mA; Max Frequency: 2484MHz; Number Of Adc Channels: 16; Number Of Gpio: 32; Interface: I2C,SPI,UART,Ethernet,I2S,Other; Data Rate: 150Mbits/s; Min Supply Voltage: 3V; Bandwidth: 72MHz; Sensitivity: -98dBm; Octopart: https://octopart.com/esp32-wroom-32d-espressif+systems-91040050; Package: ESP32-WROOM-32D; ComponentLink2URL: https://www.espressif.com/sites/default/files/documentation/esp32-wroom-32d_esp32-wroom-32u_datasheet_en.pdf; Lead Free: Yes; Category: UNK; Mouser Description: Wi-Fi/BT BLE Module ESP32-D0WD, SPI Flash, UART, P; Device Class L1: Integrated Circuits (ICs); RoHS: TRUE; Temperature Range Low: -40°C; ComponentLink2Description: Datasheet; Digikey Description: WIFI MODULE 32MBITS SPI FLASH; Height: 3.2mm; Temperature: -40°C to +85°C; Manufacturer Part Number: ESP32-WROOM-32D; Device Class L3: Transceivers; Device Class L2: RF Semiconductors and Devices; Temperature Range High: +85°C; Automotive: No
P1 = CON-BS-PLG_2X1-100-ST-TH: 2 Pins, 1 Row 2.54mm Pitch, Straight bergstrip, Male; Manufacturer Part Number: NA; Manufacturer: Samtec; Case/Package: TH-CON; Supplier-1: SP ROAD; Supplier Part Number-1: NA; Alternate Part Number-1: NA
Q1 Q2 = MMSS8050 (SMD): Bipolar (BJT) Transistor NPN 25V 1.5A 100MHz 625mW Surface Mount SOT-23; PartNumber: MMSS8050-L-TP
R4 = CMP-2002-08136-3: RES Thick Film, 10kΩ, 5%, 0.063W, 200ppm/°C, 0402; Voltage Rating: 50V; Power Rating: 63mW; Resistance: 10kR; Military Standard: Not; Packaging: Tape and Reel; Case Code (Imperial): 0402; Min Operating Temperature: -55°C; Case Code (Metric): 1005; Case/Package: 0402; Temperature Coefficient: 200ppm/°C; Termination: SMD/SMT; Composition: Thick Film; Depth: 0.5mm; Number of Terminations: 2; Contact Plating: Tin; Height: 0.016inch; Width: 0.5mm; Max Operating Temperature: 155°C; Features: Automotive AEC-Q200; Length: 1mm; Radiation Hardening: No; Max Power Dissipation: 63mW; Mount: Surface Mount; Tolerance: 5%; Package Quantity: 1; Weight: 2.3E-05oz
R5 R6 = Res 0603: SMT Resistor; VALUE: 1K
R7 = CMP-2002-08382-1: Manufacturer: Vishay Dale; Part Number: CRCW040222R0FKED
R11 = CMP-2002-08123-3: RES Thick Film, 100kΩ, 1%, 0.063W, 100ppm/°C, 0402; Power Rating: 63mW; Resistance: 100kR; Voltage Rating (DC): 50V; Lead Free: Lead Free; Height: 0.35mm; Contact Plating: Tin; Min Operating Temperature: -55°C; Package Quantity: 10000; Case/Package: 0402; Temperature Coefficient: 100ppm/°C; Number of Terminations: 2; Packaging: Tape and Reel; Max Power Dissipation: 63mW; Case Code (Metric): 1005; Mount: Surface Mount; Width: 0.02inch; Termination: SMD/SMT; Length: 1mm; Number of Pins: 2; Weight: 2.3E-05oz; Radiation Hardening: No; Tolerance: 1%; Military Standard: Not; Features: Automotive AEC-Q200; Depth: 0.5mm; Composition: Thick Film; Max Operating Temperature: 155°C; Voltage Rating: 50V; Case Code (Imperial): 0402
R12 = CMP-2002-08431-2: RES Thick Film, 27kΩ, 1%, 0.063W, 100ppm/°C, 0402; Resistance: 27kR; Power Rating: 63mW; Voltage Rating: 50V; Military Standard: Not; Height: 0.35mm; Packaging: Tape and Reel; Case/Package: 0402; Temperature Coefficient: 100ppm/°C; Composition: Thick Film; Mount: Surface Mount; Features: Automotive AEC-Q200; Tolerance: 1%; Contact Plating: Tin; Radiation Hardening: No; Depth: 0.5mm; Termination: SMD/SMT; Width: 0.02inch; Package Quantity: 10; Min Operating Temperature: -55°C; Case Code (Metric): 1005; Lead Free: Lead Free; Voltage Rating (DC): 50V; Max Operating Temperature: 155°C; Weight: 2.3E-05oz; Case Code (Imperial): 0402; Length: 1mm; Number of Terminations: 2; Max Power Dissipation: 63mW; Number of Pins: 2
R13 = CMP-2002-05880-1: Manufacturer: Panasonic; Part Number: ERA2AEB221X
U3 = IC_CH340C: USB Bridge, USB to UART USB 2.0 UART Interface; Manufacturer: Olimex; Alternate Part Number-1: NA; Manufacturer Part Number: CH340C; Case/Package: SOIC16; Supplier-1: LCSC; Supplier Part Number-1: C84681

## Sheet GSM & SIM.SchDoc
size A3; SheetNumber: 3; SheetTotal: 3; SPICEModelCacheHHWAPIZZ: <root> / <DocumentId>HHWAPIZZ</DocumentId> / </root>
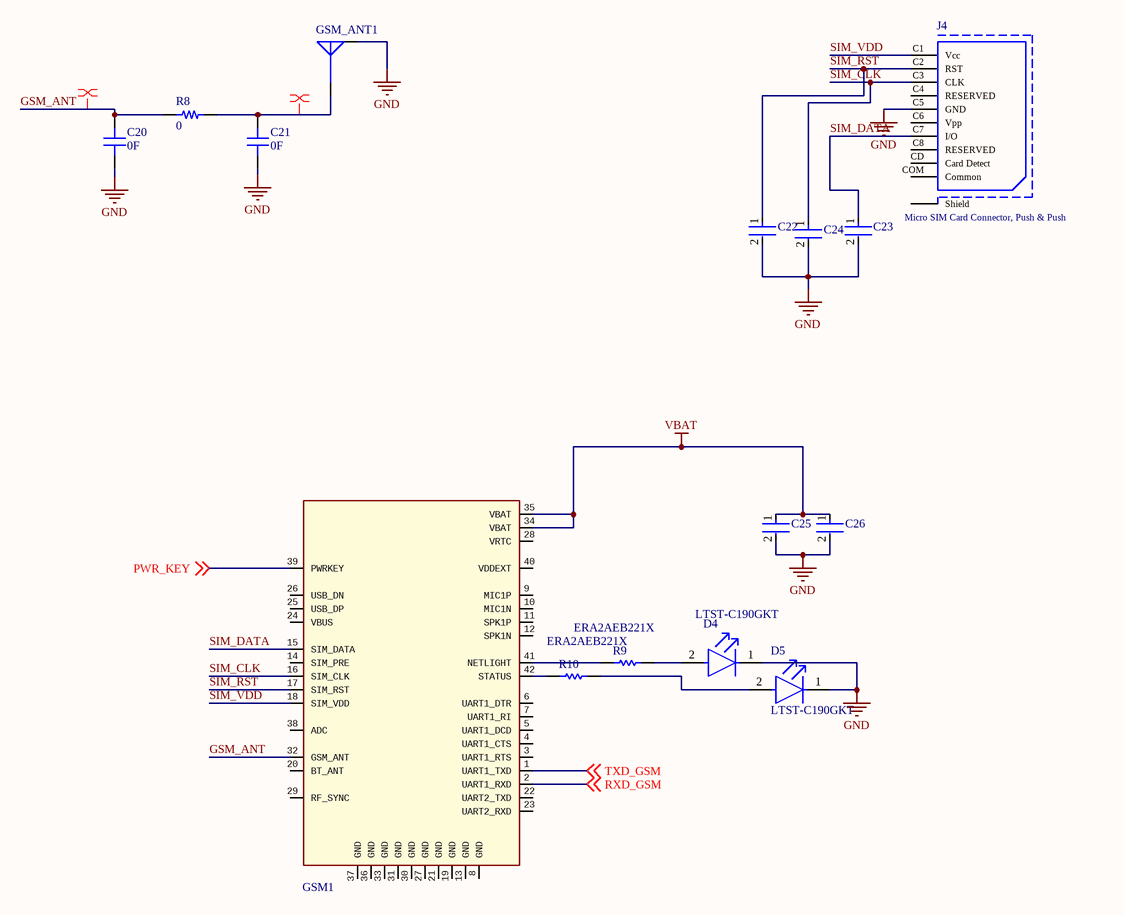
[diagram p2: GSM & SIM.SchDoc]

### Parts
C20  0F  [CAP 0402_1005]
C21  0F  [CAP 0402_1005]
C22  04023A330JAT2A  [FP-0402-L_1_0_1-W_0_5_0_1-IPC_A]  (value not drawn)
C23  04023A330JAT2A  [FP-0402-L_1_0_1-W_0_5_0_1-IPC_A]  (value not drawn)
C24  04023A330JAT2A  [FP-0402-L_1_0_1-W_0_5_0_1-IPC_A]  (value not drawn)
C25  04025A330JAT2A  [FP-0402-L_1_0_1-W_0_5_0_1-IPC_A]  (value not drawn)
C26  C1005C0G1H100D050BA  [FP-C1005-050-0_05-IPC_C]  (value not drawn)
D4  LTST-C190GKT  [FP-LTST-C190GKT-MFG]
D5  LTST-C190GKT  [FP-LTST-C190GKT-MFG]
GSM1  SIM800C  [Sim800C]  (value not drawn)
GSM_ANT1  UFL  [MOLEX SD-734120110]  (value not drawn)
J4  Micro SIM Card Connector, Push & Push  [693021010811]
R8  0  [RES 0402_1005]
R9  ERA2AEB221X  [RESC1005X40X25LL10T10]
R10  ERA2AEB221X  [RESC1005X40X25LL10T10]

### Nets
GND: C20.1 C21.1 C22.2 C23.2 C24.2 C25.2 C26.2 D4.1(C) D5.1(C) GSM_ANT1.G J4.C5(GND)
VBAT: C25.1 C26.1 GSM1.34(VBAT) GSM1.35(VBAT)
GSM_ANT: C20.2 GSM1.32(GSM_ANT) R8.1
PWR_KEY: GSM1.39(PWRKEY) ; off-sheet PWR_KEY
RXD_GSM: GSM1.2(UART1_RXD) ; off-sheet RXD_GSM
SIM_CLK: C24.1 GSM1.16(SIM_CLK) J4.C3(CLK)
SIM_DATA: C23.1 GSM1.15(SIM_DATA) J4.C7(I/O)
SIM_RST: C22.1 GSM1.17(SIM_RST) J4.C2(RST)
SIM_VDD: GSM1.18(SIM_VDD) J4.C1(Vcc)
TXD_GSM: GSM1.1(UART1_TXD) ; off-sheet TXD_GSM
NetC21_2: C21.2 GSM_ANT1.S R8.2
NetD4_2: D4.2(A) R9.2
NetD5_2: D5.2(A) R10.2
NetGSM1_41: GSM1.41(NETLIGHT) R9.1
NetGSM1_42: GSM1.42(STATUS) R10.1

Not connected (* = marked no-connect by the designer): GSM1 3(UART1_RTS) 4(UART1_CTS) 5(UART1_DCD) 6(UART1_DTR) 7(UART1_RI) 8(GND) 9(MIC1P) 10(MIC1N) 11(SPK1P) 12(SPK1N) 13(GND) 14(SIM_PRE) 19(GND) 20(BT_ANT) 21(GND) 22(UART2_TXD) 23(UART2_RXD) 24(VBUS) 25(USB_DP) 26(USB_DN) 27(GND) 28(VRTC) 29(RF_SYNC) 30(GND) 31(GND) 33(GND) 36(GND) 37(GND) 38(ADC) 40(VDDEXT); J4 C4(RESERVED) C6(Vpp) C8(RESERVED) CD(Card_Detect) COM(Common) Shield

### Layout directives
net class GSM_ANT; rule Width Constraint [Pref Impedance = 50.00ohms    Min Impedance = 50.00ohms    Max Impedance = 50.00ohms]: GSM_ANT
net class GSM_ANT: NetC21_2

### Library data of the parts
C20 C21 = Cap 0402: SMT Capacitor; VALUE: 100nF
C22-C24 = CMP-2008-02494-2: General Purpose Ceramic Capacitor, 0402, 33pF, 5%, C0G, 30ppm/°C, 25V; Case Code (Imperial): 0402; Capacitance: 33pF; Thickness: 0.022inch; Series: -; Min Operating Temperature: -55°C; Radiation Hardening: No; Lead Free: Lead Free; Voltage Rating (DC): 25V; RoHS Compliant: Yes; Dielectric: C0G; Width: 0.02inch; Package Quantity: 10000; Number of Pins: 2; Mount: Surface Mount; Packaging: Tape and Reel; Case/Package: 0402; Construction: Flat; Depth: 0.5mm; Length: 1mm; Voltage Rating: 25V; Max Operating Temperature: 125°C; Termination: SMD/SMT; Case Code (Metric): 1005; Tolerance: 5%
C25 = CMP-2008-02637-2: General Purpose Ceramic Capacitor, 0402, 33pF, 5%, C0G, 30ppm/°C, 50V; Insulation Resistance: 100GR; REACH SVHC: No SVHC; Radiation Hardening: No; Voltage Rating (DC): 50V; Tolerance: 5%; Voltage Rating: 50V; Mount: Surface Mount; Packaging: Tape and Reel; Construction: Flat; Voltage: 50V; Case/Package: 0402; Temperature Coefficient: 30ppm/°C; Lead Free: Lead Free; Case Code (Metric): 1005; Number of Pins: 2; Min Operating Temperature: -55°C; Capacitance: 33pF; Width: 0.5mm; Dielectric: C0G; Height: 0.5mm; Thickness: 0.022inch; Contact Plating: Tin; Length: 1mm; Package Quantity: 1; Depth: 0.5mm; Termination: SMD/SMT; Max Operating Temperature: 125°C; RoHS Compliant: Yes; Case Code (Imperial): 0402; Series: -
C26 = CMP-08246-002674-1: CAP CER 10PF 50V C0G 0402; Temperature Coefficient: 30ppm/°C; Dielectric Material: Ceramic; Termination: SMD/SMT; Width: 0.02inch; Case Code (Metric): 1005; Thickness: 0.022inch; Height: 0.5mm; REACH SVHC: No SVHC; Case Code (Imperial): 0402; Voltage: 50V; Capacitance: 10pF; Max Operating Temperature: 125°C; Length: 1mm; Construction: Flat; Packaging: Tape and Reel; Lead Free: Lead Free; Series: C; Depth: 0.5mm; Dielectric: C0G; Package Quantity: 1; Mount: Surface Mount; Voltage Rating (DC): 50V; Voltage Rating: 50V; Case/Package: 0402; RoHS Compliant: Yes; Min Operating Temperature: -55°C; Number of Pins: 2; Radiation Hardening: No; Weight: 2.3E-05oz
D4 D5 = CMP-22017-000005-2: as D3 on sheet power_supply; Min Operating Temperature: -55°C; Lens Style: Clear; Mount: Surface Mount; Width: 0.8mm; Packaging: Tape and Reel; Lens Transparency: Clear; Case Code (Metric): 1608; Depth: 0.8mm; Case Code (Imperial): 0603; Case/Package: 0603; Number of Pins: 2; Max Operating Temperature: 85°C; Lead Free: Lead Free; Number of Elements: 1; Length: 1.6mm; Height: 0.8mm; Package Quantity: 1; Power Rating: 100mW; Radiation Hardening: No; Illumination Color: Green; Color: Green
GSM_ANT1 = UFL MOLEX SD-734120110: PartNumber: MOLEX SD-734120110
J4 = Micro SIM Card 693021010811: WR-CRD Micro SIM Card Connector, Push & Push, with Card Detection; Rated Current: 1A; Working Voltage: 500V AC; ComponentLink1Description: Manufacturer; ComponentLink1URL: http://www.we-online.de; ComponentLink2Description: Datasheet; ComponentLink2URL: http://katalog.we-online.de/em/datasheet/693021010811.pdf; PartNumber: 693021010811; Published Date: Feb. 2018; Publisher: Wurth Elektronik; Operating Temperature: -25 to 85 degC; Mounting Technology: SMT
R8 = Res 0402: SMT Resistor; VALUE: 1K
R9 R10 = CMP-2002-05880-1: Manufacturer: Panasonic; Part Number: ERA2AEB221X

## Nets that join several sheets
+3V3: power_supply (7 pins), ESP32_MCU (11 pins)
GND: power_supply (17 pins), ESP32_MCU (23 pins), GSM & SIM (11 pins)
VBAT: power_supply (5 pins), GSM & SIM (C25.1 C26.1 GSM1.34 GSM1.35)
VIN: power_supply (7 pins), ESP32_MCU (5 pins)
PWR_KEY: ESP32_MCU (Q1.3), GSM & SIM (GSM1.39)
RXD_GSM: ESP32_MCU (MD1.28), GSM & SIM (GSM1.2)
TXD_GSM: ESP32_MCU (MD1.12), GSM & SIM (GSM1.1)